# Altium schematic sheet Power.SchDoc
size A4
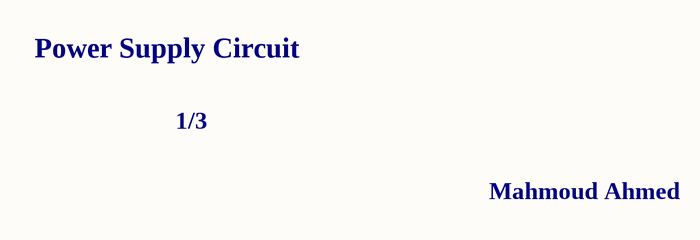
[diagram p0: Power.SchDoc]

## Notes on the sheet
- Power Supply Circuit
- 1/3
- Mahmoud Ahmed